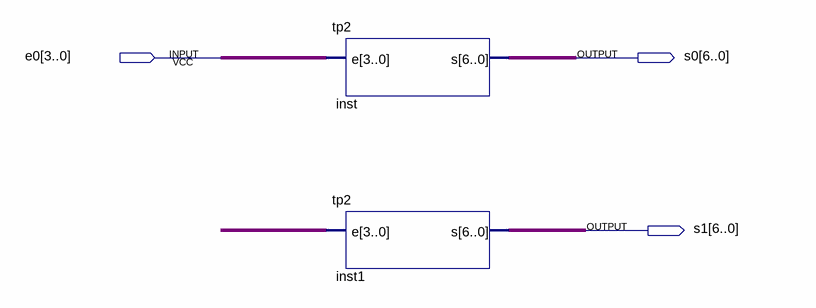
[diagram p0: schematic sheet]
// Quartus schematic tp2.bdf as structural Verilog: 2 symbols, 3 pins
module tp2 (
  input  [3:0] e0,
  output [6:0] s0,
  output [6:0] s1
);

  wire [3:0] undriven;

  tp2 inst (.e(e0), .s(s0));
  tp2 inst1 (.e(undriven), .s(s1));
endmodule
